# EAGLE schematic pirmod (EAGLE 7.2.0)
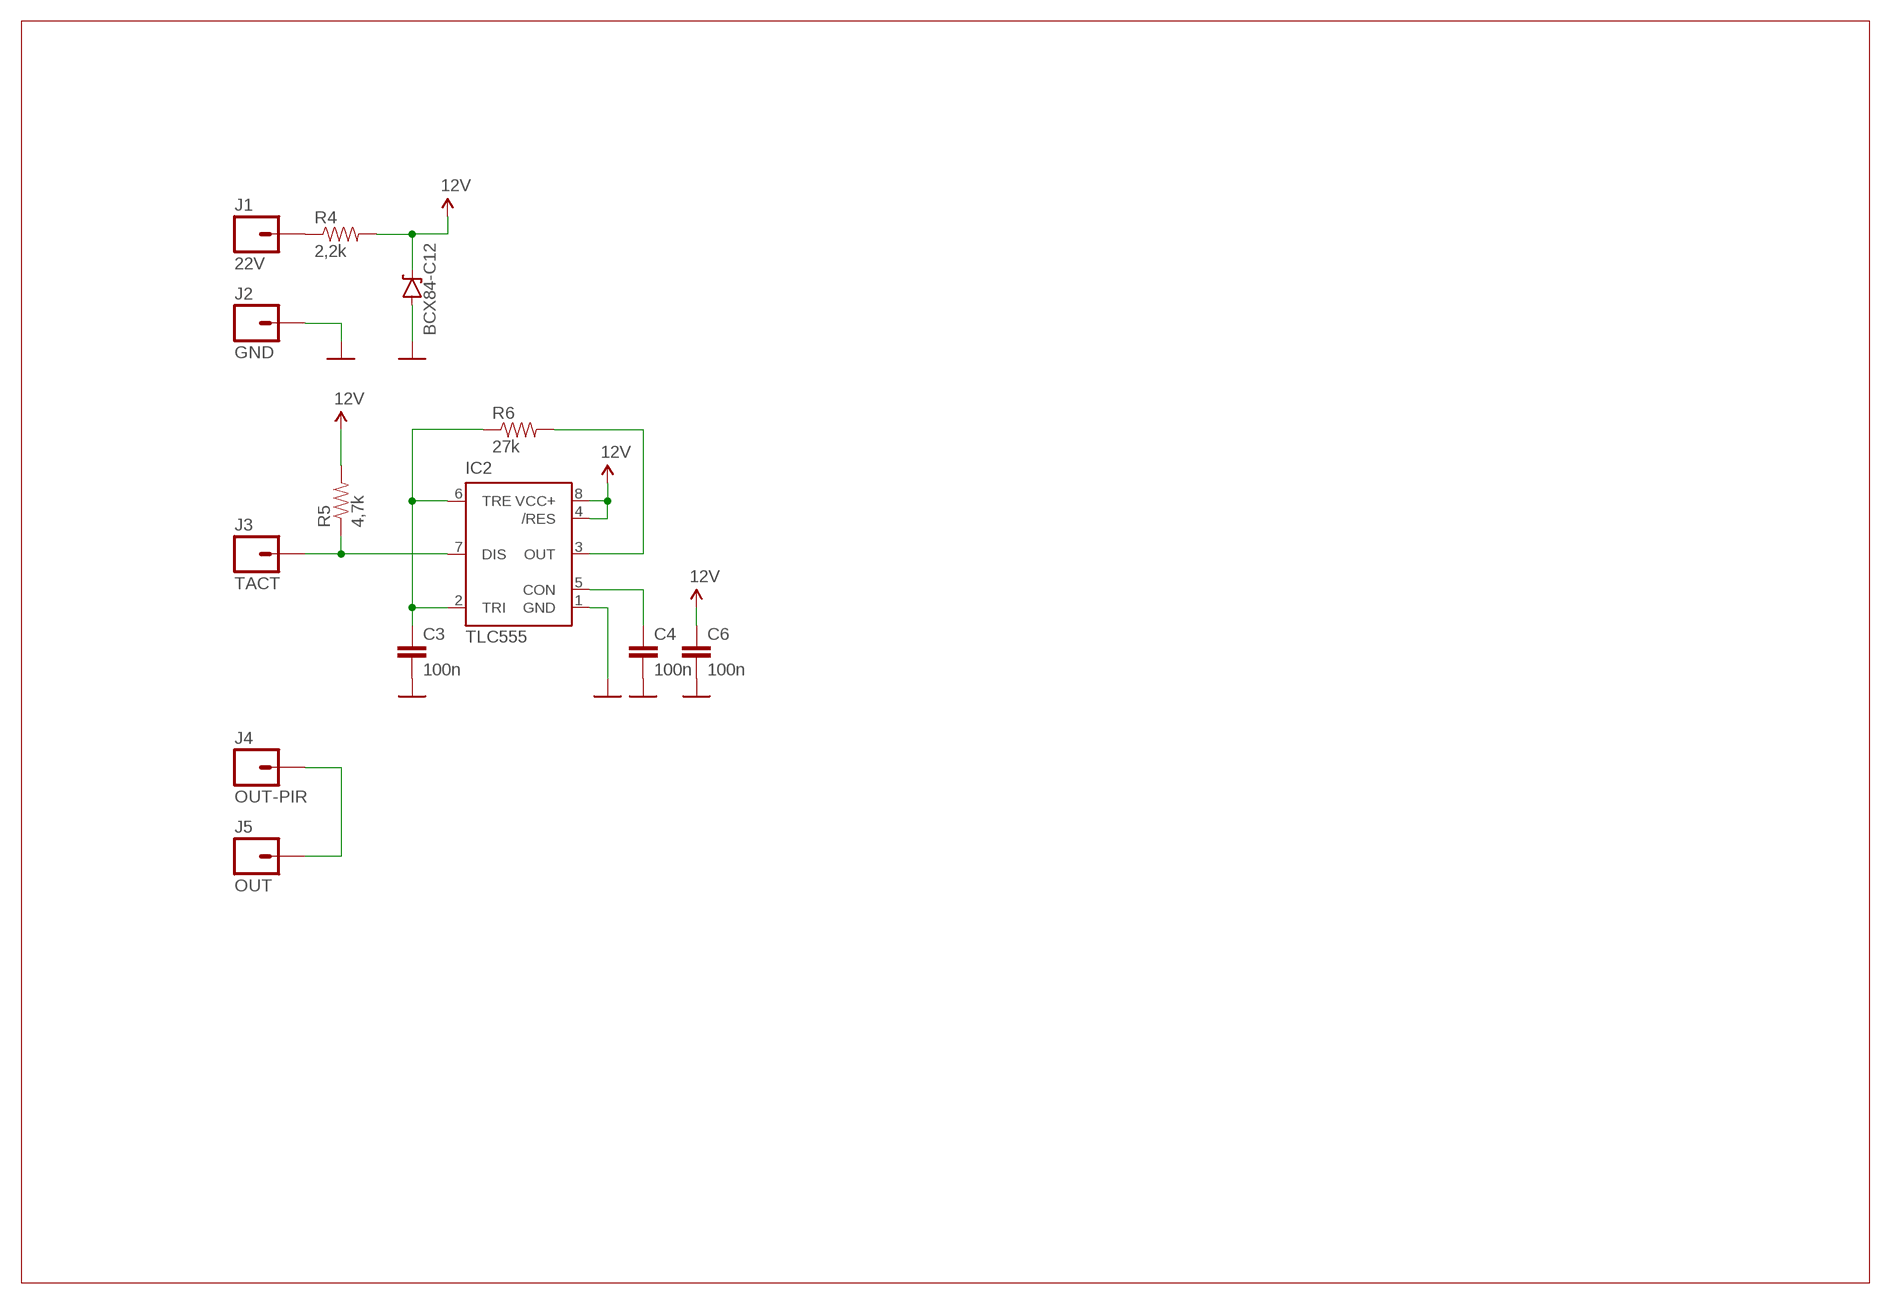
[diagram p0: schematic, sheet 1]

## Parts
C3  100n  CAP0805  [0805]
C4  100n  CAP0805  [0805]
C6  100n  CAP0805  [0805]
D2  BCX84-C12  DIODE-ZENER12V  [SOT23-3]
IC2  TLC555  NE555D  [SO08]
J1  22V  M01PTH  [1X01]
J2  GND  M01SMD-4.5X1.5  [PAD-1.5X4.5]
J3  TACT  M01PTH  [1X01]
J4  OUT-PIR  M01PTH  [1X01]
J5  OUT  M01PTH  [1X01]
R4  2,2k  RESISTOR0805-RES  [0805]
R5  4,7k  RESISTOR0805-RES  [0805]
R6  27k  RESISTOR0805-RES  [0805]

## Nets
12V: C6.1 D2.3(C) IC2.4(/RES) IC2.8(VCC+) R4.2 R5.2
GND: C3.2 C4.2 C6.2 D2.1(A) IC2.1(GND) J2.P$1
N$1: J4.1 J5.1
N$3: C3.1 IC2.2(TRI) IC2.6(TRE) R6.1
N$5: J1.1 R4.1
N$7: C4.1 IC2.5(CON)
N$8: IC2.3(OUT) R6.2
N$9: IC2.7(DIS) J3.1 R5.1

## Library data of the parts
C3 C4 C6 = SparkFun-Capacitors:CAP: Capacitor Standard 0603 ceramic capacitor, and 0.1" leaded capacitor.
D2 = SparkFun-DiscreteSemi:DIODE-ZENER: Zener Diode Production Part - 8199 3.4V Zener Voltage
IC2 = SparkFun-AnalogIC:NE555: General purpose bipolar Timer
J1-J5 = SparkFun-Connectors:M01: Header 1 Standard 1-pin 0.1" header. Use with straight break away headers (SKU : PRT-00116), right angle break away headers (PRT-00553), swiss pins (PRT-00743), machine pins (PRT-00117), and female headers (PRT-00115).
R4-R6 = SparkFun-Passives:RESISTOR: Resistor Basic schematic elements and footprints for 0603, 1206, and PTH resistors.